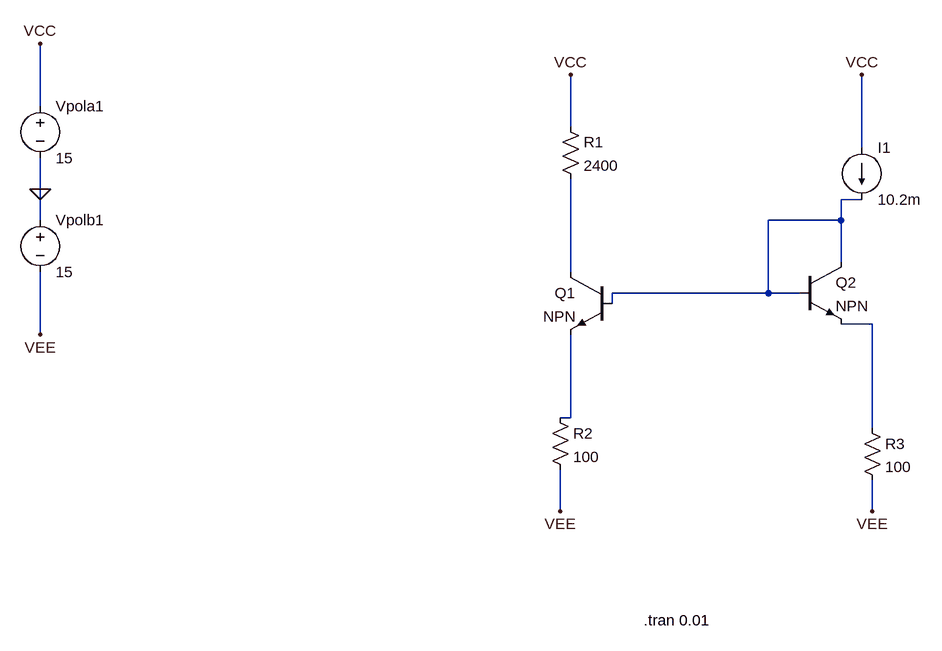
[diagram p0: schematic LT_SOURCE_HAUT.asc]
LT_SOURCE_HAUT.asc, the LTspice schematic file:
Version 4
SHEET 1 1108 680
WIRE -256 -128 -256 -224
WIRE 560 -96 560 -176
WIRE 1008 -64 1008 -176
WIRE -256 0 -256 -48
WIRE 1008 16 976 16
WIRE -256 48 -256 0
WIRE 976 48 976 16
WIRE 976 48 864 48
WIRE 976 112 976 48
WIRE 560 128 560 -16
WIRE 864 160 864 48
WIRE 864 160 624 160
WIRE 912 160 864 160
WIRE 624 176 624 160
WIRE 1024 208 976 208
WIRE -256 224 -256 128
WIRE 560 352 560 224
WIRE 560 352 544 352
WIRE 1024 368 1024 208
WIRE 544 496 544 432
WIRE 1024 496 1024 448
FLAG -256 -224 VCC
FLAG -256 224 VEE
FLAG -256 0 0
FLAG 560 -176 VCC
FLAG 1008 -176 VCC
FLAG 544 496 VEE
FLAG 1024 496 VEE
SYMBOL voltage -256 -144 R0
WINDOW 123 0 0 Left 0
WINDOW 39 0 0 Left 0
SYMATTR InstName Vpola1
SYMATTR Value 15
SYMBOL voltage -256 32 R0
WINDOW 123 0 0 Left 0
WINDOW 39 0 0 Left 0
SYMATTR InstName Vpolb1
SYMATTR Value 15
SYMBOL res 544 -112 R0
SYMATTR InstName R1
SYMATTR Value 2400
SYMBOL res 528 336 R0
SYMATTR InstName R2
SYMATTR Value 100
SYMBOL res 1008 352 R0
SYMATTR InstName R3
SYMATTR Value 100
SYMBOL npn 624 128 M0
SYMATTR InstName Q1
SYMBOL npn 912 112 R0
SYMATTR InstName Q2
SYMBOL current 1008 -64 R0
WINDOW 123 0 0 Left 0
WINDOW 39 0 0 Left 0
SYMATTR InstName I1
SYMATTR Value 10.2m
TEXT 672 664 Left 2 !.tran 0.01

The netlist it stands for:
* LT_SOURCE_HAUT.asc
Vpola1 VCC 0 15
Vpolb1 0 VEE 15
R1 VCC N002 2400
R2 N004 VEE 100
R3 N003 VEE 100
Q1 N002 N001 N004 0 NPN
Q2 N001 N001 N003 0 NPN
I1 VCC N001 10.2m
.model NPN NPN
.model PNP PNP
.lib standard.bjt
.tran 0.01
.backanno
.end